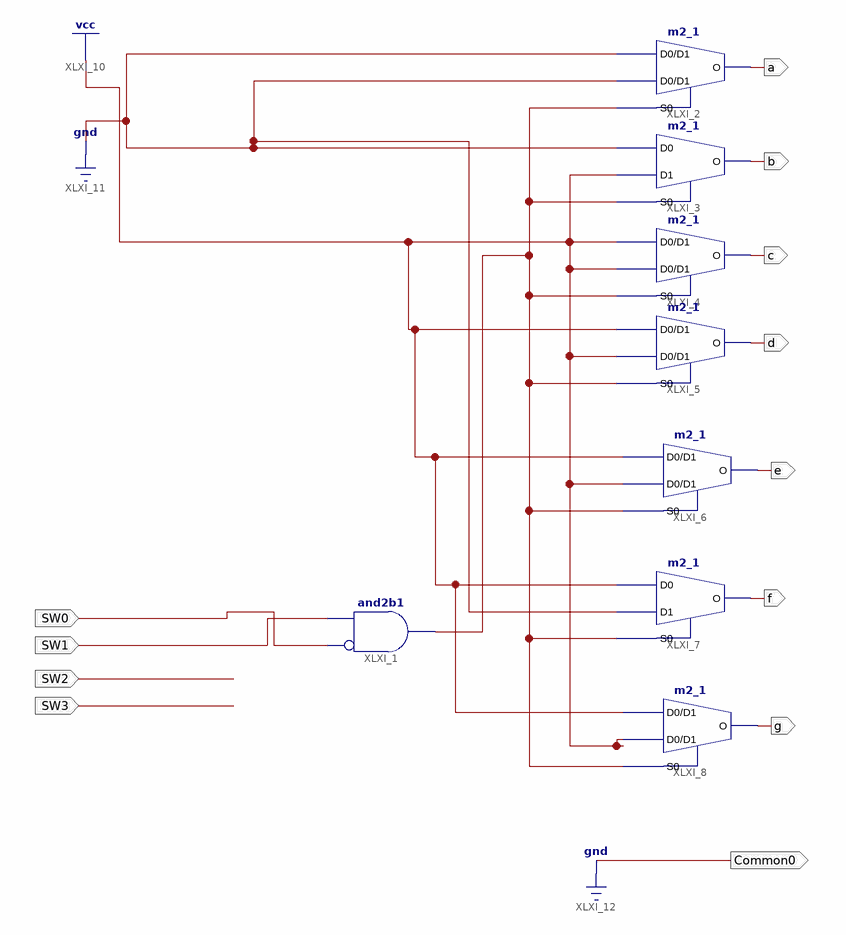
[diagram p0: schematic sheet 1]
// Xilinx ISE schematic main.sch (spartan6) as structural Verilog: 8 symbols, 12 ports
module main (
  input  SW0,
  input  SW1,
  input  SW2,
  input  SW3,
  output a,
  output b,
  output c,
  output d,
  output e,
  output f,
  output g,
  output Common0
);

  wire XLXN_5;

  m2_1 XLXI_2 (.D0(1'b0), .D1(1'b0), .S0(XLXN_5), .O(a));
  m2_1 XLXI_3 (.D0(1'b0), .D1(1'b1), .S0(XLXN_5), .O(b));
  m2_1 XLXI_4 (.D0(1'b1), .D1(1'b1), .S0(XLXN_5), .O(c));
  m2_1 XLXI_5 (.D0(1'b1), .D1(1'b1), .S0(XLXN_5), .O(d));
  m2_1 XLXI_6 (.D0(1'b1), .D1(1'b1), .S0(XLXN_5), .O(e));
  m2_1 XLXI_7 (.D0(1'b1), .D1(1'b0), .S0(XLXN_5), .O(f));
  m2_1 XLXI_8 (.D0(1'b1), .D1(1'b1), .S0(XLXN_5), .O(g));
  and XLXI_1 (XLXN_5, ~SW0, SW1);  // and2b1

  assign Common0 = 1'b0;
endmodule
